# Altium project PCB_Project-LEDs.PrjPCB
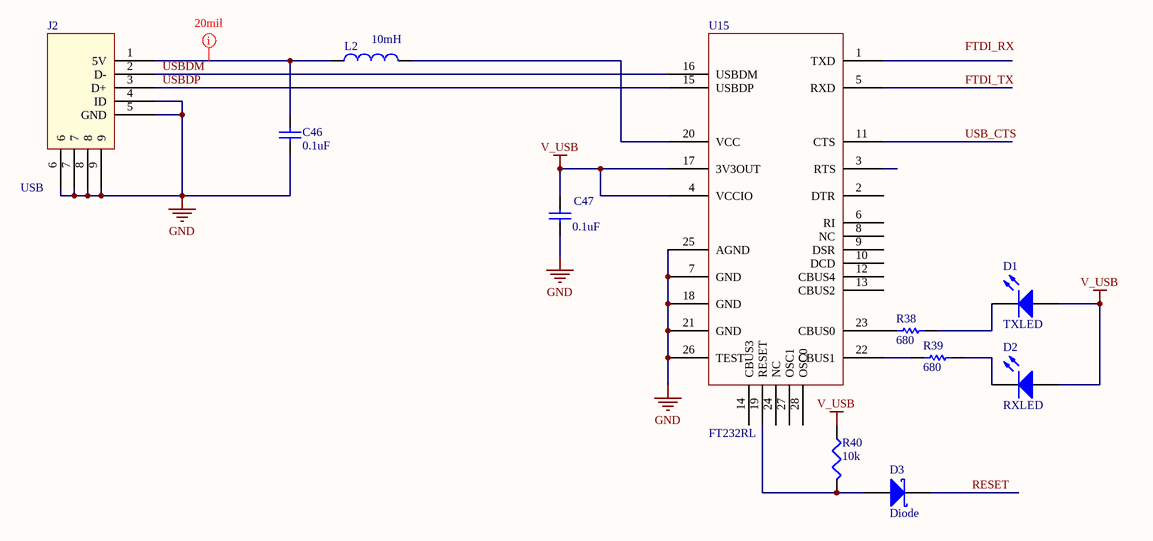
[diagram p0: USB.SchDoc]
6 sheets, 120 parts. Net scope: global (net labels, ports and power ports of the same name join across sheets).
Board file: LED_PCB.PcbDoc
Sheets:
  USB.SchDoc
  BLUELED.SchDoc
  REDLED.SchDoc
  TILE_DEMUX.SchDoc
  NEWLED.SchDoc
  LED_HEADERS.SchDoc

## Sheet USB.SchDoc
size A

### Parts
C46  value 0.1uF  [CAPC1005L]
C47  value 0.1uF  [CAPC1005L]
D1  TXLED  [INDC2012L]
D2  RXLED  [INDC2012L]
D3  Diode  [SurfaceMount(603)]
J2  USB  [USB Minib (thru-hole)]
L2  value 10mH  [INDC2012L]  (hidden comment: Inductor)
R38  value 680  [RESC1608L]
R39  value 680  [RESC1608L]
R40  value 10k  [RESC1608L]  (hidden comment: Res3)
U15  FT232RL  [SSOP-28]

### Nets
GND: C46.1 C47.1 J2.4(ID) J2.5(GND) J2.6 J2.7 J2.8 J2.9 U15.7(GND) U15.18(GND) U15.21(GND) U15.25(AGND) U15.26(TEST)
V_USB: C47.2 D1.1(A) D2.1(A) R40.1 U15.4(VCCIO) U15.17(3V3OUT)
FTDI_TX: U15.5(RXD)
RESET: D3.1(K)
USB_CTS: U15.11(CTS)
USBDM: J2.2(D-) U15.16(USBDM)
USBDP: J2.3(D+) U15.15(USBDP)
NetC46_2: C46.2 J2.1(5V) L2.1
NetD1_2: D1.2(K) R38.2
NetD2_2: D2.2(K) R39.2
NetD3_3: D3.3(A) R40.2 U15.19(RESET)
NetL2_2: L2.2 U15.20(VCC)
NetR38_1: R38.1 U15.23(CBUS0)
NetR39_1: R39.1 U15.22(CBUS1)

Not connected (* = marked no-connect by the designer): U15 1(TXD) 2(DTR) 3(RTS) 6(RI) 8(NC) 9(DSR) 10(DCD) 12(CBUS4) 13(CBUS2) 14(CBUS3) 24(NC) 27(OSC1) 28(OSC0)

### Layout directives
rule Width Constraint [Pref Width = 10mil    Min Width = 10mil    Max Width = 20mil]: NetC46_2

### Notes on the sheet
- Labels drawn without touching a wire or pin: FTDI_RX

### Library data of the parts
C46 C47 = Cap: Capacitor; Published: 8-Jun-2000; LatestRevisionDate: 17-Jul-2002; LatestRevisionNote: Re-released for DXP Platform.; PackageReference: RAD-0.3; Publisher: Altium Limited
D1 D2 = LED2: Typical RED, GREEN, YELLOW, AMBER GaAs LED; Published: 8-Jun-2000; LatestRevisionDate: 17-Jul-2002; LatestRevisionNote: Re-released for DXP Platform.; PackageVersion: Feb-2002; PackageReference: 3.2X1.6X1.1; Publisher: Altium Limited
D3 = SchottkeyDiode
J2 = USB-ConnTH
L2 = Inductor: Code_IEC: 1005; Published: 8-Jun-2000; LatestRevisionDate: 29-May-2009; LatestRevisionNote: IPC-7351 Footprint Added.; PackageReference: 0402-A; Publisher: Altium Limited; PackageDescription: Chip Inductor; Code_JEITA: 0402
R38 R39 = Res1: Resistor; Published: 8-Jun-2000; LatestRevisionDate: 17-Jul-2002; LatestRevisionNote: Re-released for DXP Platform.; PackageReference: AXIAL-0.3; Publisher: Altium Limited
R40 = Res3: Resistor; Published: 8-Jun-2000; LatestRevisionDate: 29-May-2009; LatestRevisionNote: IPC-7351 Footprint Added.; PackageReference: J1-0603; Publisher: Altium Limited; PackageDescription: Chip Resistor

## Sheet BLUELED.SchDoc
size A
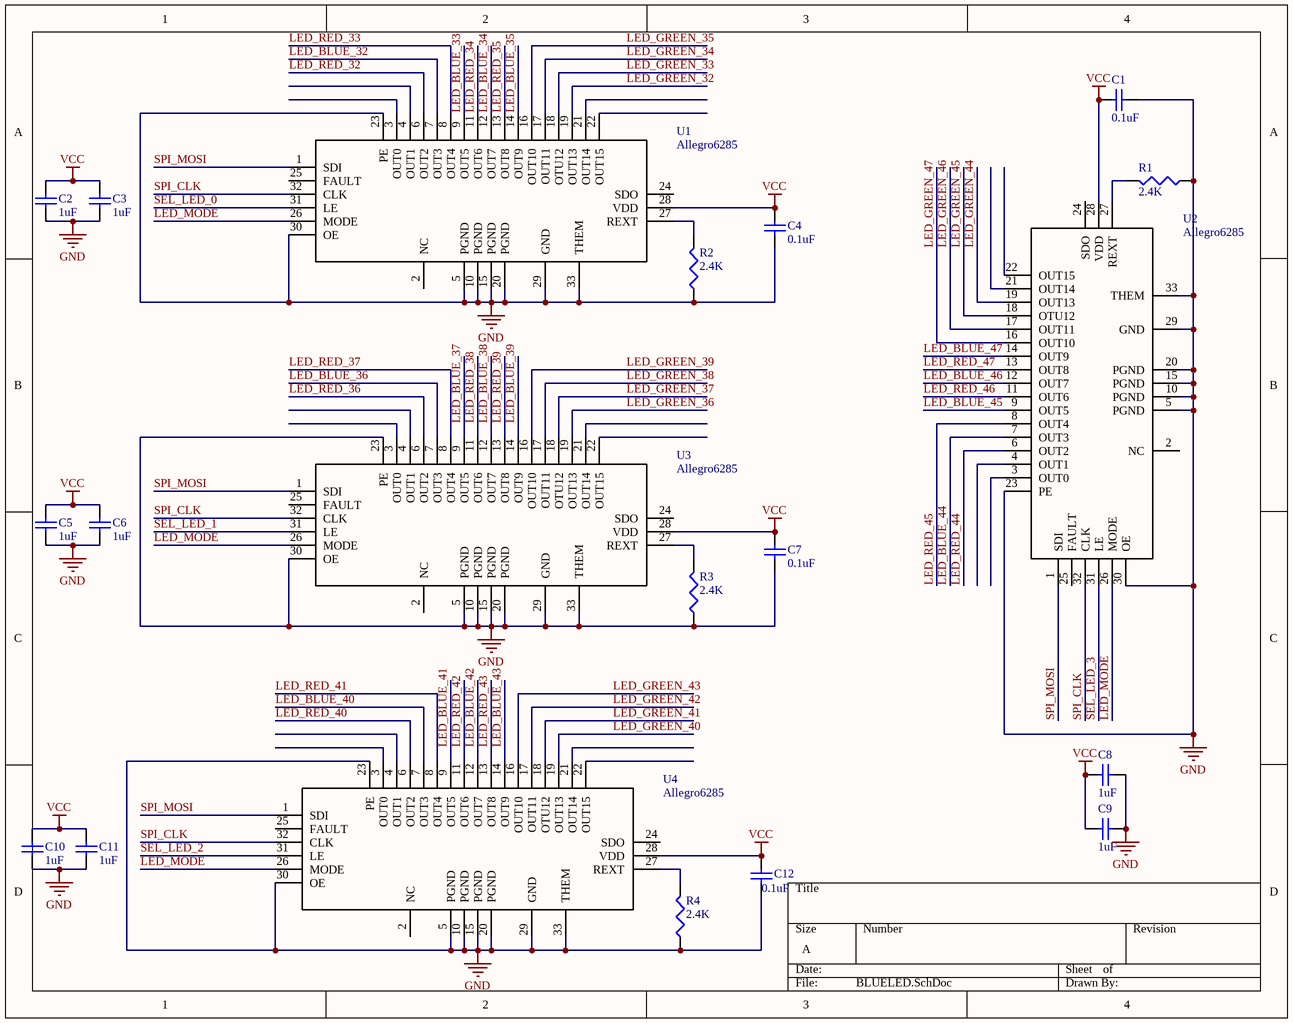
[diagram p1: BLUELED.SchDoc]

### Parts
C1  value 0.1uF  [CAPC1005L]  (hidden comment: Cap Semi)
C2  value 1uF  [CAPC1608L]  (hidden comment: Cap Semi)
C3  value 1uF  [CAPC1608L]  (hidden comment: Cap Semi)
C4  value 0.1uF  [CAPC1005L]  (hidden comment: Cap Semi)
C5  value 1uF  [CAPC1608L]  (hidden comment: Cap Semi)
C6  value 1uF  [CAPC1608L]  (hidden comment: Cap Semi)
C7  value 0.1uF  [CAPC1005L]  (hidden comment: Cap Semi)
C8  value 1uF  [CAPC1608L]  (hidden comment: Cap Semi)
C9  value 1uF  [CAPC1608L]  (hidden comment: Cap Semi)
C10  value 1uF  [CAPC1608L]  (hidden comment: Cap Semi)
C11  value 1uF  [CAPC1608L]  (hidden comment: Cap Semi)
C12  value 0.1uF  [CAPC1005L]  (hidden comment: Cap Semi)
R1  value 2.4K  [RESC1608L]  (hidden comment: Res3)
R2  value 2.4K  [RESC1608L]  (hidden comment: Res3)
R3  value 2.4K  [RESC1608L]  (hidden comment: Res3)
R4  value 2.4K  [RESC1608L]  (hidden comment: Res3)
U1  Allegro6285  [QFN-32]
U2  Allegro6285  [QFN-32]
U3  Allegro6285  [QFN-32]
U4  Allegro6285  [QFN-32]

### Nets
GND: C1.1 C2.1 C3.1 C4.1 C5.1 C6.1 C7.1 C8.1 C9.1 C10.1 C11.1 C12.1 R1.1 R2.1 R3.1 R4.1 U1.5(PGND) U1.10(PGND) U1.15(PGND) U1.20(PGND) U1.23(PE) U1.29(GND) U1.30(OE) U1.33(THEM) U2.5(PGND) U2.10(PGND) U2.15(PGND) U2.20(PGND) U2.23(PE) U2.29(GND) U2.30(OE) U2.33(THEM) U3.5(PGND) U3.10(PGND) U3.15(PGND) U3.20(PGND) U3.23(PE) U3.29(GND) U3.30(OE) U3.33(THEM) U4.5(PGND) U4.10(PGND) U4.15(PGND) U4.20(PGND) U4.23(PE) U4.29(GND) U4.30(OE) U4.33(THEM)
VCC: C1.2 C2.2 C3.2 C4.2 C5.2 C6.2 C7.2 C8.2 C9.2 C10.2 C11.2 C12.2 U1.28(VDD) U2.28(VDD) U3.28(VDD) U4.28(VDD)
LED_BLUE_32: U1.7(OUT3)
LED_BLUE_33: U1.9(OUT5)
LED_BLUE_34: U1.12(OUT7)
LED_BLUE_35: U1.14(OUT9)
LED_BLUE_36: U3.7(OUT3)
LED_BLUE_37: U3.9(OUT5)
LED_BLUE_38: U3.12(OUT7)
LED_BLUE_39: U3.14(OUT9)
LED_BLUE_40: U4.7(OUT3)
LED_BLUE_41: U4.9(OUT5)
LED_BLUE_42: U4.12(OUT7)
LED_BLUE_43: U4.14(OUT9)
LED_BLUE_44: U2.7(OUT3)
LED_BLUE_45: U2.9(OUT5)
LED_BLUE_46: U2.12(OUT7)
LED_BLUE_47: U2.14(OUT9)
LED_GREEN_32: U1.19(OUT13)
LED_GREEN_33: U1.18(OTU12)
LED_GREEN_34: U1.17(OUT11)
LED_GREEN_35: U1.16(OUT10)
LED_GREEN_36: U3.19(OUT13)
LED_GREEN_37: U3.18(OTU12)
LED_GREEN_38: U3.17(OUT11)
LED_GREEN_39: U3.16(OUT10)
LED_GREEN_40: U4.19(OUT13)
LED_GREEN_41: U4.18(OTU12)
LED_GREEN_42: U4.17(OUT11)
LED_GREEN_43: U4.16(OUT10)
LED_GREEN_44: U2.19(OUT13)
LED_GREEN_45: U2.18(OTU12)
LED_GREEN_46: U2.17(OUT11)
LED_GREEN_47: U2.16(OUT10)
LED_MODE: U1.26(MODE) U2.26(MODE) U3.26(MODE) U4.26(MODE)
LED_RED_32: U1.6(OUT2)
LED_RED_33: U1.8(OUT4)
LED_RED_34: U1.11(OUT6)
LED_RED_35: U1.13(OUT8)
LED_RED_36: U3.6(OUT2)
LED_RED_37: U3.8(OUT4)
LED_RED_38: U3.11(OUT6)
LED_RED_39: U3.13(OUT8)
LED_RED_40: U4.6(OUT2)
LED_RED_41: U4.8(OUT4)
LED_RED_42: U4.11(OUT6)
LED_RED_43: U4.13(OUT8)
LED_RED_44: U2.6(OUT2)
LED_RED_45: U2.8(OUT4)
LED_RED_46: U2.11(OUT6)
LED_RED_47: U2.13(OUT8)
SEL_LED_0: U1.31(LE)
SEL_LED_1: U3.31(LE)
SEL_LED_2: U4.31(LE)
SEL_LED_3: U2.31(LE)
SPI_CLK: U1.32(CLK) U2.32(CLK) U3.32(CLK) U4.32(CLK)
SPI_MOSI: U1.1(SDI) U2.1(SDI) U3.1(SDI) U4.1(SDI)
NetR1_2: R1.2 U2.27(REXT)
NetR2_2: R2.2 U1.27(REXT)
NetR3_2: R3.2 U3.27(REXT)
NetR4_2: R4.2 U4.27(REXT)

Not connected (* = marked no-connect by the designer): U1 2(NC) 3(OUT0) 4(OUT1) 21(OUT14) 22(OUT15) 24(SDO) 25(FAULT); U2 2(NC) 3(OUT0) 4(OUT1) 21(OUT14) 22(OUT15) 24(SDO) 25(FAULT); U3 2(NC) 3(OUT0) 4(OUT1) 21(OUT14) 22(OUT15) 24(SDO) 25(FAULT); U4 2(NC) 3(OUT0) 4(OUT1) 21(OUT14) 22(OUT15) 24(SDO) 25(FAULT)

### Library data of the parts
C1-C12 = Cap Semi: Capacitor (Semiconductor SIM Model); Published: 8-Jun-2000; LatestRevisionDate: 29-May-2009; LatestRevisionNote: IPC-7351 Footprint Added.; PackageReference: C1206; Publisher: Altium Limited; PackageDescription: Chip Capacitor
R1-R4 = Res3: Resistor; Published: 8-Jun-2000; LatestRevisionDate: 29-May-2009; LatestRevisionNote: IPC-7351 Footprint Added.; PackageReference: J1-0603; Publisher: Altium Limited; PackageDescription: Chip Resistor

## Sheet REDLED.SchDoc
size A
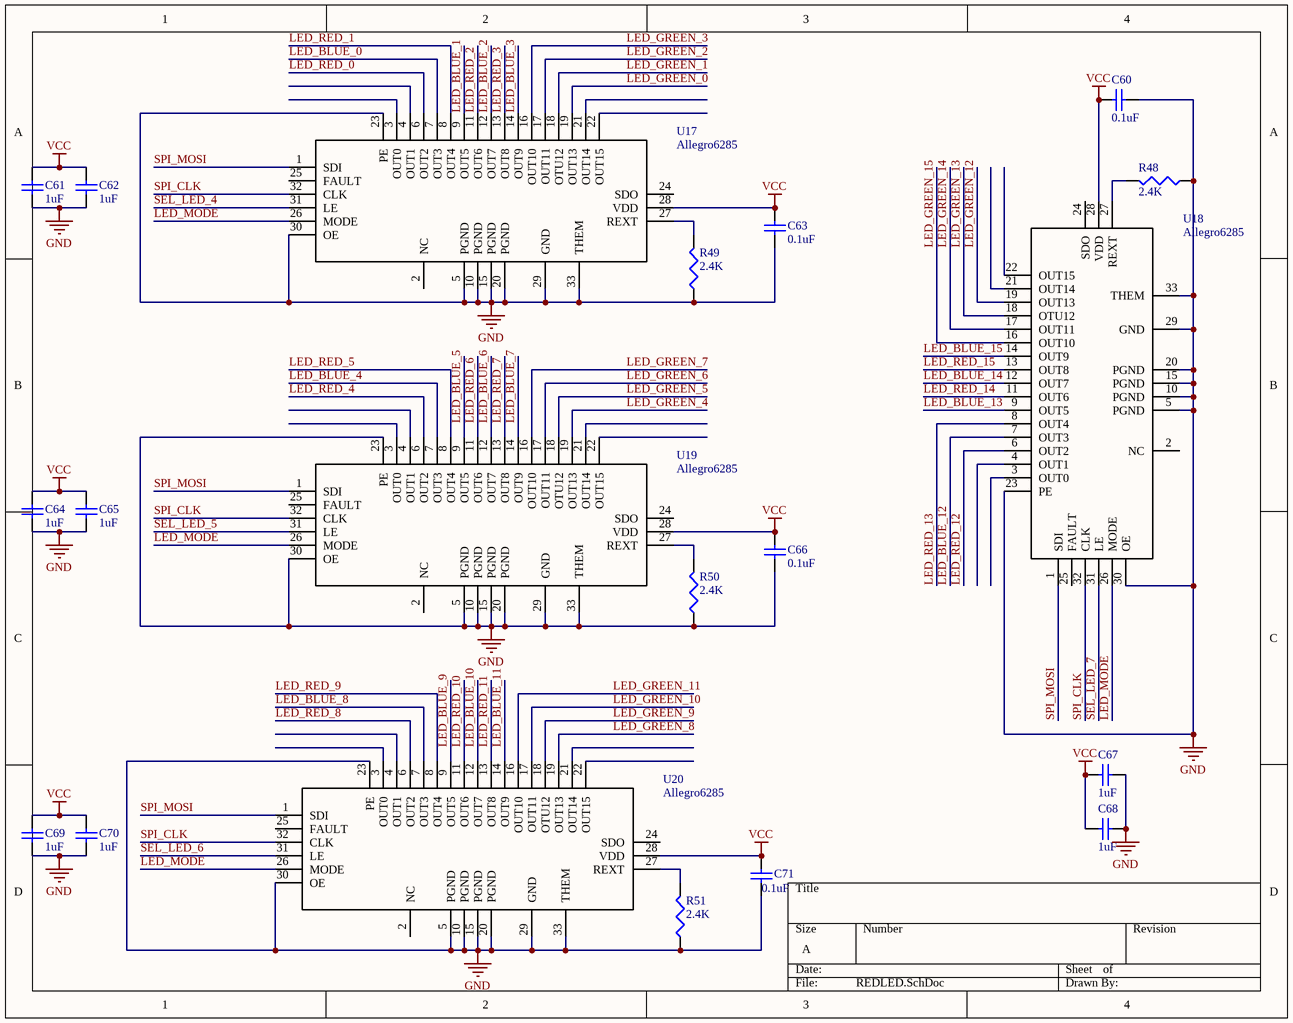
[diagram p2: REDLED.SchDoc]

### Parts
C60  value 0.1uF  [CAPC1005L]  (hidden comment: Cap Semi)
C61  value 1uF  [CAPC1608L]  (hidden comment: Cap Semi)
C62  value 1uF  [CAPC1608L]  (hidden comment: Cap Semi)
C63  value 0.1uF  [CAPC1005L]  (hidden comment: Cap Semi)
C64  value 1uF  [CAPC1608L]  (hidden comment: Cap Semi)
C65  value 1uF  [CAPC1608L]  (hidden comment: Cap Semi)
C66  value 0.1uF  [CAPC1005L]  (hidden comment: Cap Semi)
C67  value 1uF  [CAPC1608L]  (hidden comment: Cap Semi)
C68  value 1uF  [CAPC1608L]  (hidden comment: Cap Semi)
C69  value 1uF  [CAPC1608L]  (hidden comment: Cap Semi)
C70  value 1uF  [CAPC1608L]  (hidden comment: Cap Semi)
C71  value 0.1uF  [CAPC1005L]  (hidden comment: Cap Semi)
R48  value 2.4K  [RESC1608L]  (hidden comment: Res3)
R49  value 2.4K  [RESC1608L]  (hidden comment: Res3)
R50  value 2.4K  [RESC1608L]  (hidden comment: Res3)
R51  value 2.4K  [RESC1608L]  (hidden comment: Res3)
U17  Allegro6285  [QFN-32]
U18  Allegro6285  [QFN-32]
U19  Allegro6285  [QFN-32]
U20  Allegro6285  [QFN-32]

### Nets
GND: C60.1 C61.1 C62.1 C63.1 C64.1 C65.1 C66.1 C67.1 C68.1 C69.1 C70.1 C71.1 R48.1 R49.1 R50.1 R51.1 U17.5(PGND) U17.10(PGND) U17.15(PGND) U17.20(PGND) U17.23(PE) U17.29(GND) U17.30(OE) U17.33(THEM) U18.5(PGND) U18.10(PGND) U18.15(PGND) U18.20(PGND) U18.23(PE) U18.29(GND) U18.30(OE) U18.33(THEM) U19.5(PGND) U19.10(PGND) U19.15(PGND) U19.20(PGND) U19.23(PE) U19.29(GND) U19.30(OE) U19.33(THEM) U20.5(PGND) U20.10(PGND) U20.15(PGND) U20.20(PGND) U20.23(PE) U20.29(GND) U20.30(OE) U20.33(THEM)
VCC: C60.2 C61.2 C62.2 C63.2 C64.2 C65.2 C66.2 C67.2 C68.2 C69.2 C70.2 C71.2 U17.28(VDD) U18.28(VDD) U19.28(VDD) U20.28(VDD)
LED_BLUE_0: U17.7(OUT3)
LED_BLUE_1: U17.9(OUT5)
LED_BLUE_2: U17.12(OUT7)
LED_BLUE_3: U17.14(OUT9)
LED_BLUE_4: U19.7(OUT3)
LED_BLUE_5: U19.9(OUT5)
LED_BLUE_6: U19.12(OUT7)
LED_BLUE_7: U19.14(OUT9)
LED_BLUE_8: U20.7(OUT3)
LED_BLUE_9: U20.9(OUT5)
LED_BLUE_10: U20.12(OUT7)
LED_BLUE_11: U20.14(OUT9)
LED_BLUE_12: U18.7(OUT3)
LED_BLUE_13: U18.9(OUT5)
LED_BLUE_14: U18.12(OUT7)
LED_BLUE_15: U18.14(OUT9)
LED_GREEN_0: U17.19(OUT13)
LED_GREEN_1: U17.18(OTU12)
LED_GREEN_2: U17.17(OUT11)
LED_GREEN_3: U17.16(OUT10)
LED_GREEN_4: U19.19(OUT13)
LED_GREEN_5: U19.18(OTU12)
LED_GREEN_6: U19.17(OUT11)
LED_GREEN_7: U19.16(OUT10)
LED_GREEN_8: U20.19(OUT13)
LED_GREEN_9: U20.18(OTU12)
LED_GREEN_10: U20.17(OUT11)
LED_GREEN_11: U20.16(OUT10)
LED_GREEN_12: U18.19(OUT13)
LED_GREEN_13: U18.18(OTU12)
LED_GREEN_14: U18.17(OUT11)
LED_GREEN_15: U18.16(OUT10)
LED_MODE: U17.26(MODE) U18.26(MODE) U19.26(MODE) U20.26(MODE)
LED_RED_0: U17.6(OUT2)
LED_RED_1: U17.8(OUT4)
LED_RED_2: U17.11(OUT6)
LED_RED_3: U17.13(OUT8)
LED_RED_4: U19.6(OUT2)
LED_RED_5: U19.8(OUT4)
LED_RED_6: U19.11(OUT6)
LED_RED_7: U19.13(OUT8)
LED_RED_8: U20.6(OUT2)
LED_RED_9: U20.8(OUT4)
LED_RED_10: U20.11(OUT6)
LED_RED_11: U20.13(OUT8)
LED_RED_12: U18.6(OUT2)
LED_RED_13: U18.8(OUT4)
LED_RED_14: U18.11(OUT6)
LED_RED_15: U18.13(OUT8)
SEL_LED_4: U17.31(LE)
SEL_LED_5: U19.31(LE)
SEL_LED_6: U20.31(LE)
SEL_LED_7: U18.31(LE)
SPI_CLK: U17.32(CLK) U18.32(CLK) U19.32(CLK) U20.32(CLK)
SPI_MOSI: U17.1(SDI) U18.1(SDI) U19.1(SDI) U20.1(SDI)
NetR48_2: R48.2 U18.27(REXT)
NetR49_2: R49.2 U17.27(REXT)
NetR50_2: R50.2 U19.27(REXT)
NetR51_2: R51.2 U20.27(REXT)

Not connected (* = marked no-connect by the designer): U17 2(NC) 3(OUT0) 4(OUT1) 21(OUT14) 22(OUT15) 24(SDO) 25(FAULT); U18 2(NC) 3(OUT0) 4(OUT1) 21(OUT14) 22(OUT15) 24(SDO) 25(FAULT); U19 2(NC) 3(OUT0) 4(OUT1) 21(OUT14) 22(OUT15) 24(SDO) 25(FAULT); U20 2(NC) 3(OUT0) 4(OUT1) 21(OUT14) 22(OUT15) 24(SDO) 25(FAULT)

### Library data of the parts
C60-C71 = Cap Semi: Capacitor (Semiconductor SIM Model); Published: 8-Jun-2000; LatestRevisionDate: 29-May-2009; LatestRevisionNote: IPC-7351 Footprint Added.; PackageReference: C1206; Publisher: Altium Limited; PackageDescription: Chip Capacitor
R48-R51 = Res3: Resistor; Published: 8-Jun-2000; LatestRevisionDate: 29-May-2009; LatestRevisionNote: IPC-7351 Footprint Added.; PackageReference: J1-0603; Publisher: Altium Limited; PackageDescription: Chip Resistor

## Sheet TILE_DEMUX.SchDoc
size A
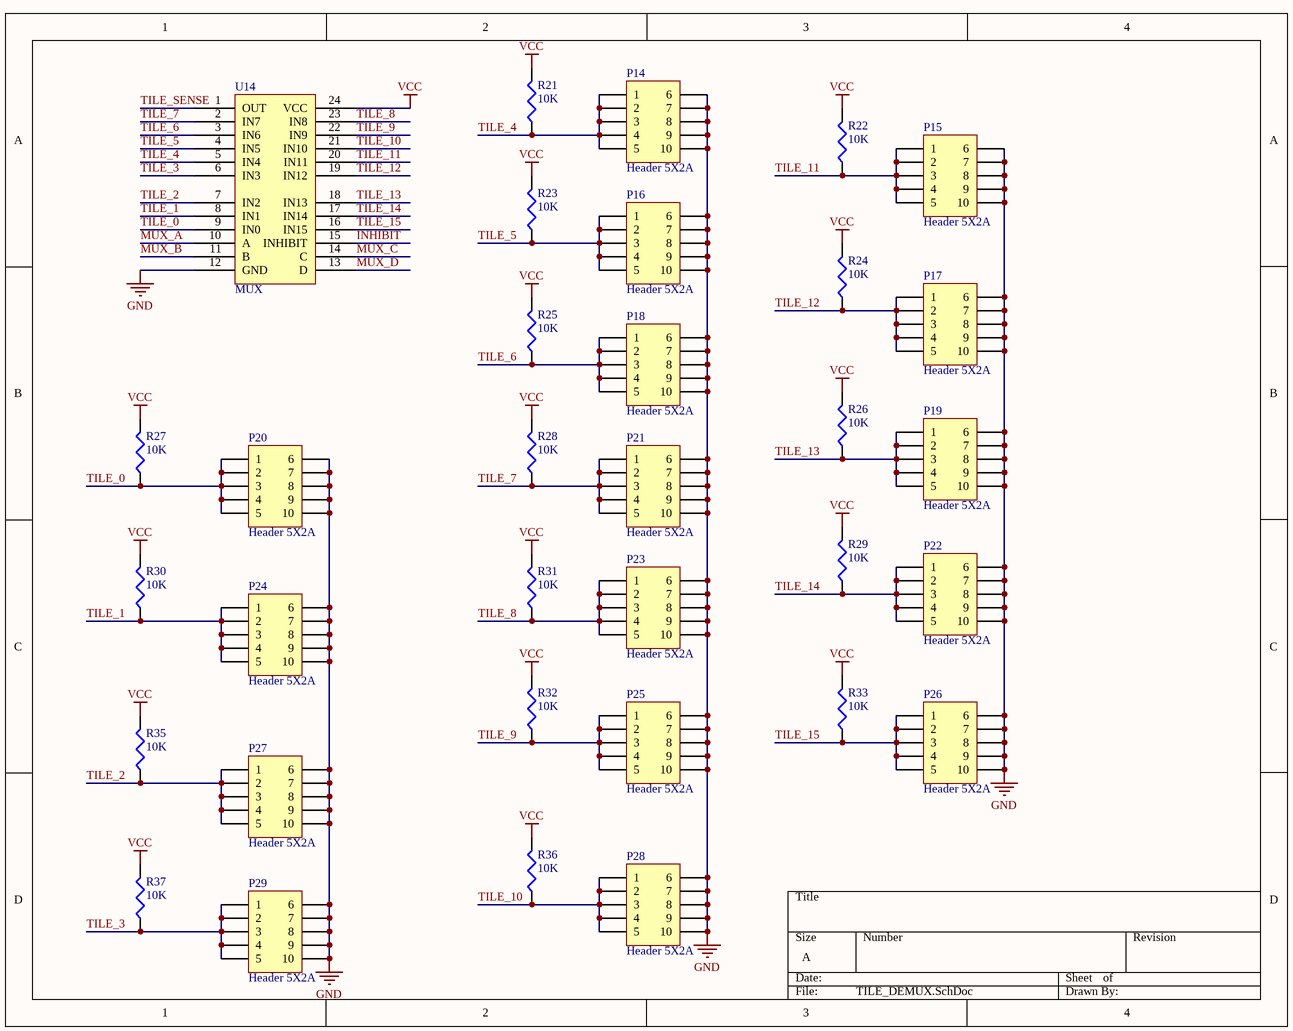
[diagram p3: TILE_DEMUX.SchDoc]

### Parts
P14  Header 5X2A  [HDR2X5_CEN]
P15  Header 5X2A  [HDR2X5_CEN]
P16  Header 5X2A  [HDR2X5_CEN]
P17  Header 5X2A  [HDR2X5_CEN]
P18  Header 5X2A  [HDR2X5_CEN]
P19  Header 5X2A  [HDR2X5_CEN]
P20  Header 5X2A  [HDR2X5_CEN]
P21  Header 5X2A  [HDR2X5_CEN]
P22  Header 5X2A  [HDR2X5_CEN]
P23  Header 5X2A  [HDR2X5_CEN]
P24  Header 5X2A  [HDR2X5_CEN]
P25  Header 5X2A  [HDR2X5_CEN]
P26  Header 5X2A  [HDR2X5_CEN]
P27  Header 5X2A  [HDR2X5_CEN]
P28  Header 5X2A  [HDR2X5_CEN]
P29  Header 5X2A  [HDR2X5_CEN]
R21  value 10K  [RESC1608L]  (hidden comment: Res3)
R22  value 10K  [RESC1608L]  (hidden comment: Res3)
R23  value 10K  [RESC1608L]  (hidden comment: Res3)
R24  value 10K  [RESC1608L]  (hidden comment: Res3)
R25  value 10K  [RESC1608L]  (hidden comment: Res3)
R26  value 10K  [RESC1608L]  (hidden comment: Res3)
R27  value 10K  [RESC1608L]  (hidden comment: Res3)
R28  value 10K  [RESC1608L]  (hidden comment: Res3)
R29  value 10K  [RESC1608L]  (hidden comment: Res3)
R30  value 10K  [RESC1608L]  (hidden comment: Res3)
R31  value 10K  [RESC1608L]  (hidden comment: Res3)
R32  value 10K  [RESC1608L]  (hidden comment: Res3)
R33  value 10K  [RESC1608L]  (hidden comment: Res3)
R35  value 10K  [RESC1608L]  (hidden comment: Res3)
R36  value 10K  [RESC1608L]  (hidden comment: Res3)
R37  value 10K  [RESC1608L]  (hidden comment: Res3)
U14  MUX  [SOIC-24MUX]

### Nets
GND: P14.6 P14.7 P14.8 P14.9 P14.10 P15.6 P15.7 P15.8 P15.9 P15.10 P16.6 P16.7 P16.8 P16.9 P16.10 P17.6 P17.7 P17.8 P17.9 P17.10 P18.6 P18.7 P18.8 P18.9 P18.10 P19.6 P19.7 P19.8 P19.9 P19.10 P20.6 P20.7 P20.8 P20.9 P20.10 P21.6 P21.7 P21.8 P21.9 P21.10 P22.6 P22.7 P22.8 P22.9 P22.10 P23.6 P23.7 P23.8 P23.9 P23.10 P24.6 P24.7 P24.8 P24.9 P24.10 P25.6 P25.7 P25.8 P25.9 P25.10 P26.6 P26.7 P26.8 P26.9 P26.10 P27.6 P27.7 P27.8 P27.9 P27.10 P28.6 P28.7 P28.8 P28.9 P28.10 P29.6 P29.7 P29.8 P29.9 P29.10 U14.12(GND)
VCC: R21.2 R22.2 R23.2 R24.2 R25.2 R26.2 R27.2 R28.2 R29.2 R30.2 R31.2 R32.2 R33.2 R35.2 R36.2 R37.2 U14.24(VCC)
INHIBIT: U14.15(INHIBIT)
MUX_A: U14.10(A)
MUX_B: U14.11(B)
MUX_C: U14.14(C)
MUX_D: U14.13(D)
TILE_0: P20.1 P20.2 P20.3 P20.4 P20.5 R27.1 U14.9(IN0)
TILE_1: P24.1 P24.2 P24.3 P24.4 P24.5 R30.1 U14.8(IN1)
TILE_2: P27.1 P27.2 P27.3 P27.4 P27.5 R35.1 U14.7(IN2)
TILE_3: P29.1 P29.2 P29.3 P29.4 P29.5 R37.1 U14.6(IN3)
TILE_4: P14.1 P14.2 P14.3 P14.4 P14.5 R21.1 U14.5(IN4)
TILE_5: P16.1 P16.2 P16.3 P16.4 P16.5 R23.1 U14.4(IN5)
TILE_6: P18.1 P18.2 P18.3 P18.4 P18.5 R25.1 U14.3(IN6)
TILE_7: P21.1 P21.2 P21.3 P21.4 P21.5 R28.1 U14.2(IN7)
TILE_8: P23.1 P23.2 P23.3 P23.4 P23.5 R31.1 U14.23(IN8)
TILE_9: P25.1 P25.2 P25.3 P25.4 P25.5 R32.1 U14.22(IN9)
TILE_10: P28.1 P28.2 P28.3 P28.4 P28.5 R36.1 U14.21(IN10)
TILE_11: P15.1 P15.2 P15.3 P15.4 P15.5 R22.1 U14.20(IN11)
TILE_12: P17.1 P17.2 P17.3 P17.4 P17.5 R24.1 U14.19(IN12)
TILE_13: P19.1 P19.2 P19.3 P19.4 P19.5 R26.1 U14.18(IN13)
TILE_14: P22.1 P22.2 P22.3 P22.4 P22.5 R29.1 U14.17(IN14)
TILE_15: P26.1 P26.2 P26.3 P26.4 P26.5 R33.1 U14.16(IN15)
TILE_SENSE: U14.1(OUT)

### Library data of the parts
P14-P29 = Header 5X2A: Header, 5-Pin, Dual row; LatestRevisionDate: 17-Jul-2002; LatestRevisionNote: Re-released for DXP Platform.; Publisher: Altium Limited
R21-R33 R35-R37 = Res3: Resistor; Published: 8-Jun-2000; LatestRevisionDate: 29-May-2009; LatestRevisionNote: IPC-7351 Footprint Added.; PackageReference: J1-0603; Publisher: Altium Limited; PackageDescription: Chip Resistor

## Sheet NEWLED.SchDoc
size A
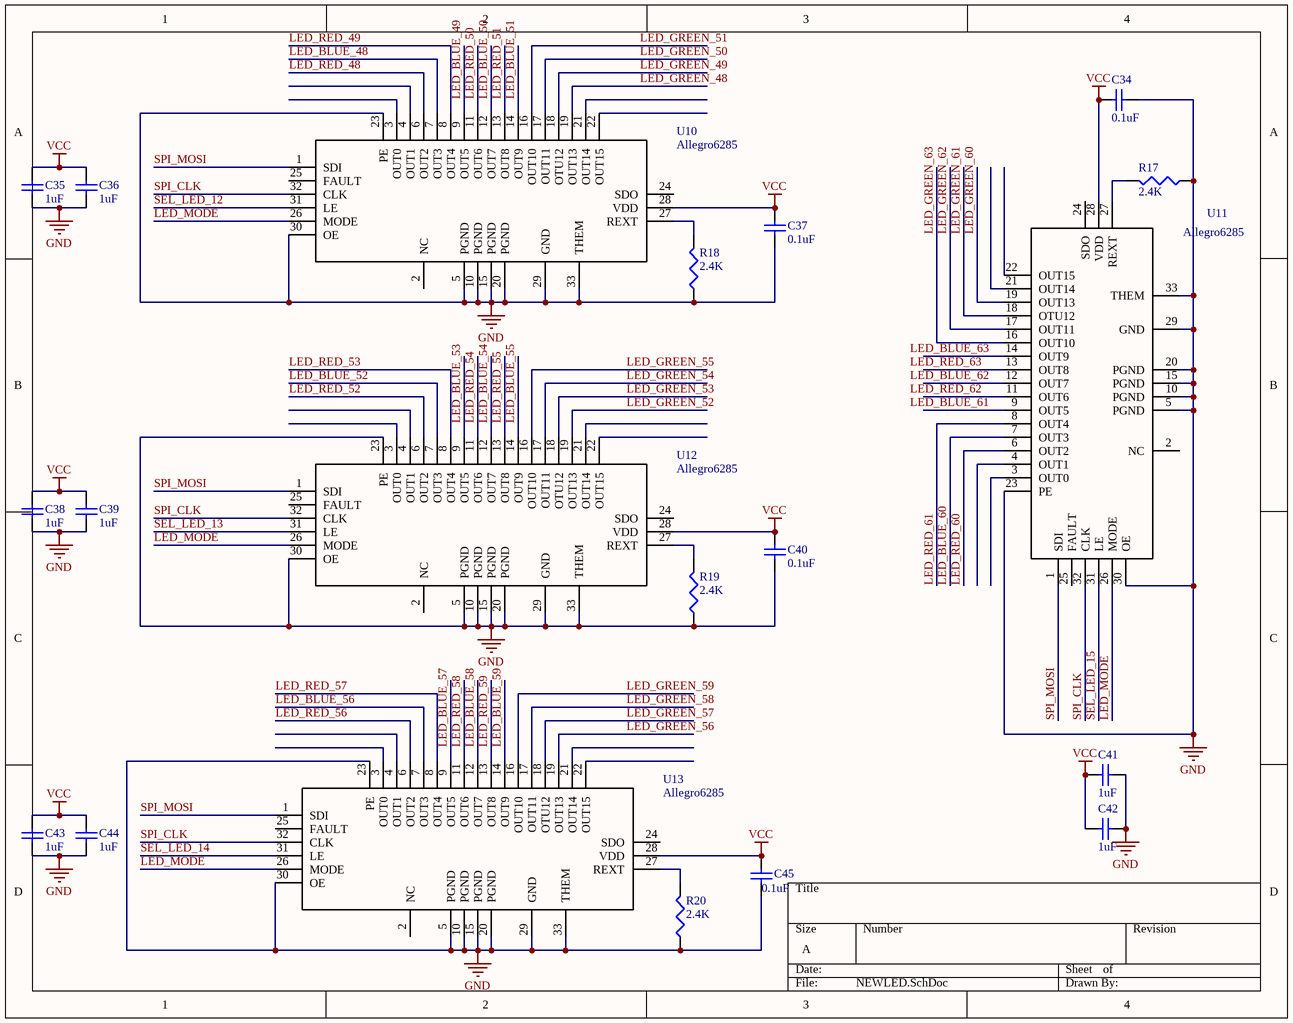
[diagram p4: NEWLED.SchDoc]

### Parts
C34  value 0.1uF  [CAPC1005L]  (hidden comment: Cap Semi)
C35  value 1uF  [CAPC1608L]  (hidden comment: Cap Semi)
C36  value 1uF  [CAPC1608L]  (hidden comment: Cap Semi)
C37  value 0.1uF  [CAPC1005L]  (hidden comment: Cap Semi)
C38  value 1uF  [CAPC1608L]  (hidden comment: Cap Semi)
C39  value 1uF  [CAPC1608L]  (hidden comment: Cap Semi)
C40  value 0.1uF  [CAPC1005L]  (hidden comment: Cap Semi)
C41  value 1uF  [CAPC1608L]  (hidden comment: Cap Semi)
C42  value 1uF  [CAPC1608L]  (hidden comment: Cap Semi)
C43  value 1uF  [CAPC1608L]  (hidden comment: Cap Semi)
C44  value 1uF  [CAPC1608L]  (hidden comment: Cap Semi)
C45  value 0.1uF  [CAPC1005L]  (hidden comment: Cap Semi)
R17  value 2.4K  [RESC1608L]  (hidden comment: Res3)
R18  value 2.4K  [RESC1608L]  (hidden comment: Res3)
R19  value 2.4K  [RESC1608L]  (hidden comment: Res3)
R20  value 2.4K  [RESC1608L]  (hidden comment: Res3)
U10  Allegro6285  [QFN-32]
U11  Allegro6285  [QFN-32]
U12  Allegro6285  [QFN-32]
U13  Allegro6285  [QFN-32]

### Nets
GND: C34.1 C35.1 C36.1 C37.1 C38.1 C39.1 C40.1 C41.1 C42.1 C43.1 C44.1 C45.1 R17.1 R18.1 R19.1 R20.1 U10.5(PGND) U10.10(PGND) U10.15(PGND) U10.20(PGND) U10.23(PE) U10.29(GND) U10.30(OE) U10.33(THEM) U11.5(PGND) U11.10(PGND) U11.15(PGND) U11.20(PGND) U11.23(PE) U11.29(GND) U11.30(OE) U11.33(THEM) U12.5(PGND) U12.10(PGND) U12.15(PGND) U12.20(PGND) U12.23(PE) U12.29(GND) U12.30(OE) U12.33(THEM) U13.5(PGND) U13.10(PGND) U13.15(PGND) U13.20(PGND) U13.23(PE) U13.29(GND) U13.30(OE) U13.33(THEM)
VCC: C34.2 C35.2 C36.2 C37.2 C38.2 C39.2 C40.2 C41.2 C42.2 C43.2 C44.2 C45.2 U10.28(VDD) U11.28(VDD) U12.28(VDD) U13.28(VDD)
LED_BLUE_48: U10.7(OUT3)
LED_BLUE_49: U10.9(OUT5)
LED_BLUE_50: U10.12(OUT7)
LED_BLUE_51: U10.14(OUT9)
LED_BLUE_52: U12.7(OUT3)
LED_BLUE_53: U12.9(OUT5)
LED_BLUE_54: U12.12(OUT7)
LED_BLUE_55: U12.14(OUT9)
LED_BLUE_56: U13.7(OUT3)
LED_BLUE_57: U13.9(OUT5)
LED_BLUE_58: U13.12(OUT7)
LED_BLUE_59: U13.14(OUT9)
LED_BLUE_60: U11.7(OUT3)
LED_GREEN_48: U10.19(OUT13)
LED_GREEN_49: U10.18(OTU12)
LED_GREEN_50: U10.17(OUT11)
LED_GREEN_51: U10.16(OUT10)
LED_GREEN_52: U12.19(OUT13)
LED_GREEN_53: U12.18(OTU12)
LED_GREEN_54: U12.17(OUT11)
LED_GREEN_55: U12.16(OUT10)
LED_GREEN_56: U13.19(OUT13)
LED_GREEN_57: U13.18(OTU12)
LED_GREEN_58: U13.17(OUT11)
LED_GREEN_59: U13.16(OUT10)
LED_GREEN_60: U11.19(OUT13)
LED_GREEN_61: U11.18(OTU12)
LED_GREEN_62: U11.17(OUT11)
LED_GREEN_63: U11.16(OUT10)
LED_MODE: U10.26(MODE) U11.26(MODE) U12.26(MODE) U13.26(MODE)
LED_RED_48: U10.6(OUT2)
LED_RED_49: U10.8(OUT4)
LED_RED_50: U10.11(OUT6)
LED_RED_51: U10.13(OUT8)
LED_RED_52: U12.6(OUT2)
LED_RED_53: U12.8(OUT4)
LED_RED_54: U12.11(OUT6)
LED_RED_55: U12.13(OUT8)
LED_RED_56: U13.6(OUT2)
LED_RED_57: U13.8(OUT4)
LED_RED_58: U13.11(OUT6)
LED_RED_59: U13.13(OUT8)
LED_RED_60: U11.6(OUT2)
LED_RED_61: U11.8(OUT4)
SEL_LED_12: U10.31(LE)
SEL_LED_13: U12.31(LE)
SEL_LED_14: U13.31(LE)
SEL_LED_15: U11.31(LE)
SPI_CLK: U10.32(CLK) U11.32(CLK) U12.32(CLK) U13.32(CLK)
SPI_MOSI: U10.1(SDI) U11.1(SDI) U12.1(SDI) U13.1(SDI)
NetR17_2: R17.2 U11.27(REXT)
NetR18_2: R18.2 U10.27(REXT)
NetR19_2: R19.2 U12.27(REXT)
NetR20_2: R20.2 U13.27(REXT)

Not connected (* = marked no-connect by the designer): U10 2(NC) 3(OUT0) 4(OUT1) 21(OUT14) 22(OUT15) 24(SDO) 25(FAULT); U11 2(NC) 3(OUT0) 4(OUT1) 9(OUT5) 11(OUT6) 12(OUT7) 13(OUT8) 14(OUT9) 21(OUT14) 22(OUT15) 24(SDO) 25(FAULT); U12 2(NC) 3(OUT0) 4(OUT1) 21(OUT14) 22(OUT15) 24(SDO) 25(FAULT); U13 2(NC) 3(OUT0) 4(OUT1) 21(OUT14) 22(OUT15) 24(SDO) 25(FAULT)

### Notes on the sheet
- Labels drawn without touching a wire or pin: LED_BLUE_61, LED_BLUE_62, LED_BLUE_63, LED_RED_62, LED_RED_63

### Library data of the parts
C34-C45 = Cap Semi: Capacitor (Semiconductor SIM Model); Published: 8-Jun-2000; LatestRevisionDate: 29-May-2009; LatestRevisionNote: IPC-7351 Footprint Added.; PackageReference: C1206; Publisher: Altium Limited; PackageDescription: Chip Capacitor
R17-R20 = Res3: Resistor; Published: 8-Jun-2000; LatestRevisionDate: 29-May-2009; LatestRevisionNote: IPC-7351 Footprint Added.; PackageReference: J1-0603; Publisher: Altium Limited; PackageDescription: Chip Resistor

## Sheet LED_HEADERS.SchDoc
size A
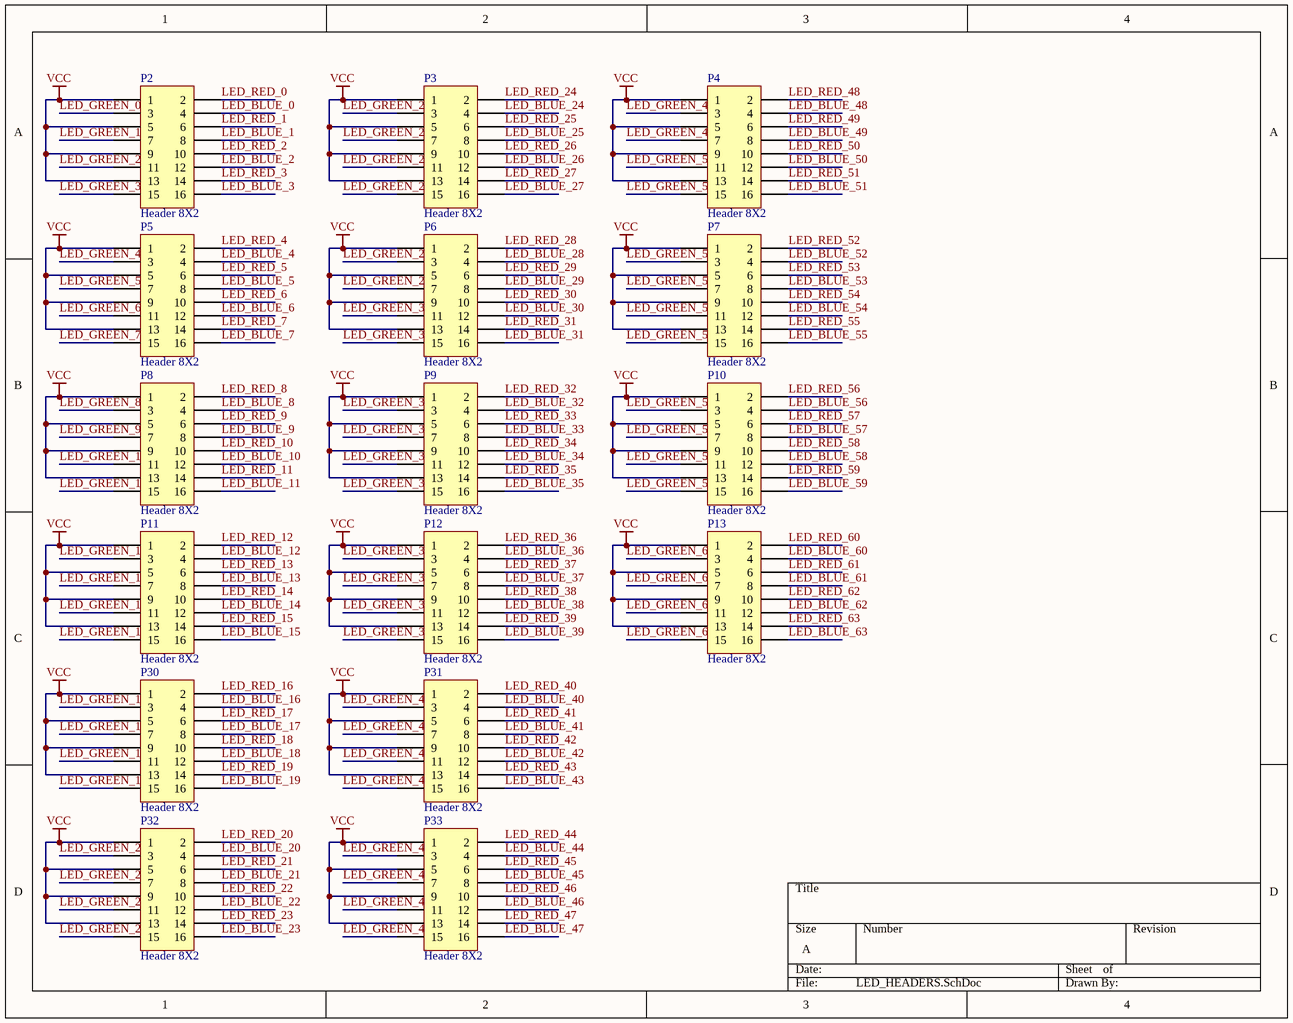
[diagram p5: LED_HEADERS.SchDoc]

### Parts
P2  Header 8X2  [HDR2X8]
P3  Header 8X2  [HDR2X8]
P4  Header 8X2  [HDR2X8]
P5  Header 8X2  [HDR2X8]
P6  Header 8X2  [HDR2X8]
P7  Header 8X2  [HDR2X8]
P8  Header 8X2  [HDR2X8]
P9  Header 8X2  [HDR2X8]
P10  Header 8X2  [HDR2X8]
P11  Header 8X2  [HDR2X8]
P12  Header 8X2  [HDR2X8]
P13  Header 8X2  [HDR2X8]
P30  Header 8X2  [HDR2X8]
P31  Header 8X2  [HDR2X8]
P32  Header 8X2  [HDR2X8]
P33  Header 8X2  [HDR2X8]

### Nets
VCC: P2.1 P2.5 P2.9 P2.13 P3.1 P3.5 P3.9 P3.13 P4.1 P4.5 P4.9 P4.13 P5.1 P5.5 P5.9 P5.13 P6.1 P6.5 P6.9 P6.13 P7.1 P7.5 P7.9 P7.13 P8.1 P8.5 P8.9 P8.13 P9.1 P9.5 P9.9 P9.13 P10.1 P10.5 P10.9 P10.13 P11.1 P11.5 P11.9 P11.13 P12.1 P12.5 P12.9 P12.13 P13.1 P13.5 P13.9 P13.13 P30.1 P30.5 P30.9 P30.13 P31.1 P31.5 P31.9 P31.13 P32.1 P32.5 P32.9 P32.13 P33.1 P33.5 P33.9 P33.13
LED_BLUE_0: P2.4
LED_BLUE_1: P2.8
LED_BLUE_2: P2.12
LED_BLUE_3: P2.16
LED_BLUE_4: P5.4
LED_BLUE_5: P5.8
LED_BLUE_6: P5.12
LED_BLUE_7: P5.16
LED_BLUE_8: P8.4
LED_BLUE_9: P8.8
LED_BLUE_10: P8.12
LED_BLUE_11: P8.16
LED_BLUE_12: P11.4
LED_BLUE_13: P11.8
LED_BLUE_14: P11.12
LED_BLUE_15: P11.16
LED_BLUE_16: P30.4
LED_BLUE_17: P30.8
LED_BLUE_18: P30.12
LED_BLUE_19: P30.16
LED_BLUE_20: P32.4
LED_BLUE_21: P32.8
LED_BLUE_22: P32.12
LED_BLUE_23: P32.16
LED_BLUE_24: P3.4
LED_BLUE_25: P3.8
LED_BLUE_26: P3.12
LED_BLUE_27: P3.16
LED_BLUE_28: P6.4
LED_BLUE_29: P6.8
LED_BLUE_30: P6.12
LED_BLUE_31: P6.16
LED_BLUE_32: P9.4
LED_BLUE_33: P9.8
LED_BLUE_34: P9.12
LED_BLUE_35: P9.16
LED_BLUE_36: P12.4
LED_BLUE_37: P12.8
LED_BLUE_38: P12.12
LED_BLUE_39: P12.16
LED_BLUE_40: P31.4
LED_BLUE_41: P31.8
LED_BLUE_42: P31.12
LED_BLUE_43: P31.16
LED_BLUE_44: P33.4
LED_BLUE_45: P33.8
LED_BLUE_46: P33.12
LED_BLUE_47: P33.16
LED_BLUE_48: P4.4
LED_BLUE_49: P4.8
LED_BLUE_50: P4.12
LED_BLUE_51: P4.16
LED_BLUE_52: P7.4
LED_BLUE_53: P7.8
LED_BLUE_54: P7.12
LED_BLUE_55: P7.16
LED_BLUE_56: P10.4
LED_BLUE_57: P10.8
LED_BLUE_58: P10.12
LED_BLUE_59: P10.16
LED_BLUE_60: P13.4
LED_BLUE_61: P13.8
LED_BLUE_62: P13.12
LED_BLUE_63: P13.16
LED_GREEN_0: P2.3
LED_GREEN_1: P2.7
LED_GREEN_2: P2.11
LED_GREEN_3: P2.15
LED_GREEN_4: P5.3
LED_GREEN_5: P5.7
LED_GREEN_6: P5.11
LED_GREEN_7: P5.15
LED_GREEN_8: P8.3
LED_GREEN_9: P8.7
LED_GREEN_10: P8.11
LED_GREEN_11: P8.15
LED_GREEN_12: P11.3
LED_GREEN_13: P11.7
LED_GREEN_14: P11.11
LED_GREEN_15: P11.15
LED_GREEN_16: P30.3
LED_GREEN_17: P30.7
LED_GREEN_18: P30.11
LED_GREEN_19: P30.15
LED_GREEN_20: P32.3
LED_GREEN_21: P32.7
LED_GREEN_22: P32.11
LED_GREEN_23: P32.15
LED_GREEN_24: P3.3
LED_GREEN_25: P3.7
LED_GREEN_26: P3.11
LED_GREEN_27: P3.15
LED_GREEN_28: P6.3
LED_GREEN_29: P6.7
LED_GREEN_30: P6.11
LED_GREEN_31: P6.15
LED_GREEN_32: P9.3
LED_GREEN_33: P9.7
LED_GREEN_34: P9.11
LED_GREEN_35: P9.15
LED_GREEN_36: P12.3
LED_GREEN_37: P12.7
LED_GREEN_38: P12.11
LED_GREEN_39: P12.15
LED_GREEN_40: P31.3
LED_GREEN_41: P31.7
LED_GREEN_42: P31.11
LED_GREEN_43: P31.15
LED_GREEN_44: P33.3
LED_GREEN_45: P33.7
LED_GREEN_46: P33.11
LED_GREEN_47: P33.15
LED_GREEN_48: P4.3
LED_GREEN_49: P4.7
LED_GREEN_50: P4.11
LED_GREEN_51: P4.15
LED_GREEN_52: P7.3
LED_GREEN_53: P7.7
LED_GREEN_54: P7.11
LED_GREEN_55: P7.15
LED_GREEN_56: P10.3
LED_GREEN_57: P10.7
LED_GREEN_58: P10.11
LED_GREEN_59: P10.15
LED_GREEN_60: P13.3
LED_GREEN_61: P13.7
LED_GREEN_62: P13.11
LED_GREEN_63: P13.15
LED_RED_0: P2.2
LED_RED_1: P2.6
LED_RED_2: P2.10
LED_RED_3: P2.14
LED_RED_4: P5.2
LED_RED_5: P5.6
LED_RED_6: P5.10
LED_RED_7: P5.14
LED_RED_8: P8.2
LED_RED_9: P8.6
LED_RED_10: P8.10
LED_RED_11: P8.14
LED_RED_12: P11.2
LED_RED_13: P11.6
LED_RED_14: P11.10
LED_RED_15: P11.14
LED_RED_16: P30.2
LED_RED_17: P30.6
LED_RED_18: P30.10
LED_RED_19: P30.14
LED_RED_20: P32.2
LED_RED_21: P32.6
LED_RED_22: P32.10
LED_RED_23: P32.14
LED_RED_24: P3.2
LED_RED_25: P3.6
LED_RED_26: P3.10
LED_RED_27: P3.14
LED_RED_28: P6.2
LED_RED_29: P6.6
LED_RED_30: P6.10
LED_RED_31: P6.14
LED_RED_32: P9.2
LED_RED_33: P9.6
LED_RED_34: P9.10
LED_RED_35: P9.14
LED_RED_36: P12.2
LED_RED_37: P12.6
LED_RED_38: P12.10
LED_RED_39: P12.14
LED_RED_40: P31.2
LED_RED_41: P31.6
LED_RED_42: P31.10
LED_RED_43: P31.14
LED_RED_44: P33.2
LED_RED_45: P33.6
LED_RED_46: P33.10
LED_RED_47: P33.14
LED_RED_48: P4.2
LED_RED_49: P4.6
LED_RED_50: P4.10
LED_RED_51: P4.14
LED_RED_52: P7.2
LED_RED_53: P7.6
LED_RED_54: P7.10
LED_RED_55: P7.14
LED_RED_56: P10.2
LED_RED_57: P10.6
LED_RED_58: P10.10
LED_RED_59: P10.14
LED_RED_60: P13.2
LED_RED_61: P13.6
LED_RED_62: P13.10
LED_RED_63: P13.14

### Library data of the parts
P2-P13 P30-P33 = Header 8X2: Header, 8-Pin, Dual row; LatestRevisionDate: 17-Jul-2002; LatestRevisionNote: Re-released for DXP Platform.; Publisher: Altium Limited

## Nets that join several sheets
GND: USB (13 pins), BLUELED (48 pins), REDLED (48 pins), TILE_DEMUX (81 pins), NEWLED (48 pins)
VCC: BLUELED (16 pins), REDLED (16 pins), TILE_DEMUX (17 pins), NEWLED (16 pins), LED_HEADERS (64 pins)
LED_BLUE_0: REDLED (U17.7), LED_HEADERS (P2.4)
LED_BLUE_1: REDLED (U17.9), LED_HEADERS (P2.8)
LED_BLUE_2: REDLED (U17.12), LED_HEADERS (P2.12)
LED_BLUE_3: REDLED (U17.14), LED_HEADERS (P2.16)
LED_BLUE_4: REDLED (U19.7), LED_HEADERS (P5.4)
LED_BLUE_5: REDLED (U19.9), LED_HEADERS (P5.8)
LED_BLUE_6: REDLED (U19.12), LED_HEADERS (P5.12)
LED_BLUE_7: REDLED (U19.14), LED_HEADERS (P5.16)
LED_BLUE_8: REDLED (U20.7), LED_HEADERS (P8.4)
LED_BLUE_9: REDLED (U20.9), LED_HEADERS (P8.8)
LED_BLUE_10: REDLED (U20.12), LED_HEADERS (P8.12)
LED_BLUE_11: REDLED (U20.14), LED_HEADERS (P8.16)
LED_BLUE_12: REDLED (U18.7), LED_HEADERS (P11.4)
LED_BLUE_13: REDLED (U18.9), LED_HEADERS (P11.8)
LED_BLUE_14: REDLED (U18.12), LED_HEADERS (P11.12)
LED_BLUE_15: REDLED (U18.14), LED_HEADERS (P11.16)
LED_BLUE_32: BLUELED (U1.7), LED_HEADERS (P9.4)
LED_BLUE_33: BLUELED (U1.9), LED_HEADERS (P9.8)
LED_BLUE_34: BLUELED (U1.12), LED_HEADERS (P9.12)
LED_BLUE_35: BLUELED (U1.14), LED_HEADERS (P9.16)
LED_BLUE_36: BLUELED (U3.7), LED_HEADERS (P12.4)
LED_BLUE_37: BLUELED (U3.9), LED_HEADERS (P12.8)
LED_BLUE_38: BLUELED (U3.12), LED_HEADERS (P12.12)
LED_BLUE_39: BLUELED (U3.14), LED_HEADERS (P12.16)
LED_BLUE_40: BLUELED (U4.7), LED_HEADERS (P31.4)
LED_BLUE_41: BLUELED (U4.9), LED_HEADERS (P31.8)
LED_BLUE_42: BLUELED (U4.12), LED_HEADERS (P31.12)
LED_BLUE_43: BLUELED (U4.14), LED_HEADERS (P31.16)
LED_BLUE_44: BLUELED (U2.7), LED_HEADERS (P33.4)
LED_BLUE_45: BLUELED (U2.9), LED_HEADERS (P33.8)
LED_BLUE_46: BLUELED (U2.12), LED_HEADERS (P33.12)
LED_BLUE_47: BLUELED (U2.14), LED_HEADERS (P33.16)
LED_BLUE_48: NEWLED (U10.7), LED_HEADERS (P4.4)
LED_BLUE_49: NEWLED (U10.9), LED_HEADERS (P4.8)
LED_BLUE_50: NEWLED (U10.12), LED_HEADERS (P4.12)
LED_BLUE_51: NEWLED (U10.14), LED_HEADERS (P4.16)
LED_BLUE_52: NEWLED (U12.7), LED_HEADERS (P7.4)
LED_BLUE_53: NEWLED (U12.9), LED_HEADERS (P7.8)
LED_BLUE_54: NEWLED (U12.12), LED_HEADERS (P7.12)
LED_BLUE_55: NEWLED (U12.14), LED_HEADERS (P7.16)
LED_BLUE_56: NEWLED (U13.7), LED_HEADERS (P10.4)
LED_BLUE_57: NEWLED (U13.9), LED_HEADERS (P10.8)
LED_BLUE_58: NEWLED (U13.12), LED_HEADERS (P10.12)
LED_BLUE_59: NEWLED (U13.14), LED_HEADERS (P10.16)
LED_BLUE_60: NEWLED (U11.7), LED_HEADERS (P13.4)
LED_GREEN_0: REDLED (U17.19), LED_HEADERS (P2.3)
LED_GREEN_1: REDLED (U17.18), LED_HEADERS (P2.7)
LED_GREEN_2: REDLED (U17.17), LED_HEADERS (P2.11)
LED_GREEN_3: REDLED (U17.16), LED_HEADERS (P2.15)
LED_GREEN_4: REDLED (U19.19), LED_HEADERS (P5.3)
LED_GREEN_5: REDLED (U19.18), LED_HEADERS (P5.7)
LED_GREEN_6: REDLED (U19.17), LED_HEADERS (P5.11)
LED_GREEN_7: REDLED (U19.16), LED_HEADERS (P5.15)
LED_GREEN_8: REDLED (U20.19), LED_HEADERS (P8.3)
LED_GREEN_9: REDLED (U20.18), LED_HEADERS (P8.7)
LED_GREEN_10: REDLED (U20.17), LED_HEADERS (P8.11)
LED_GREEN_11: REDLED (U20.16), LED_HEADERS (P8.15)
LED_GREEN_12: REDLED (U18.19), LED_HEADERS (P11.3)
LED_GREEN_13: REDLED (U18.18), LED_HEADERS (P11.7)
LED_GREEN_14: REDLED (U18.17), LED_HEADERS (P11.11)
LED_GREEN_15: REDLED (U18.16), LED_HEADERS (P11.15)
LED_GREEN_32: BLUELED (U1.19), LED_HEADERS (P9.3)
LED_GREEN_33: BLUELED (U1.18), LED_HEADERS (P9.7)
LED_GREEN_34: BLUELED (U1.17), LED_HEADERS (P9.11)
LED_GREEN_35: BLUELED (U1.16), LED_HEADERS (P9.15)
LED_GREEN_36: BLUELED (U3.19), LED_HEADERS (P12.3)
LED_GREEN_37: BLUELED (U3.18), LED_HEADERS (P12.7)
LED_GREEN_38: BLUELED (U3.17), LED_HEADERS (P12.11)
LED_GREEN_39: BLUELED (U3.16), LED_HEADERS (P12.15)
LED_GREEN_40: BLUELED (U4.19), LED_HEADERS (P31.3)
LED_GREEN_41: BLUELED (U4.18), LED_HEADERS (P31.7)
LED_GREEN_42: BLUELED (U4.17), LED_HEADERS (P31.11)
LED_GREEN_43: BLUELED (U4.16), LED_HEADERS (P31.15)
LED_GREEN_44: BLUELED (U2.19), LED_HEADERS (P33.3)
LED_GREEN_45: BLUELED (U2.18), LED_HEADERS (P33.7)
LED_GREEN_46: BLUELED (U2.17), LED_HEADERS (P33.11)
LED_GREEN_47: BLUELED (U2.16), LED_HEADERS (P33.15)
LED_GREEN_48: NEWLED (U10.19), LED_HEADERS (P4.3)
LED_GREEN_49: NEWLED (U10.18), LED_HEADERS (P4.7)
LED_GREEN_50: NEWLED (U10.17), LED_HEADERS (P4.11)
LED_GREEN_51: NEWLED (U10.16), LED_HEADERS (P4.15)
LED_GREEN_52: NEWLED (U12.19), LED_HEADERS (P7.3)
LED_GREEN_53: NEWLED (U12.18), LED_HEADERS (P7.7)
LED_GREEN_54: NEWLED (U12.17), LED_HEADERS (P7.11)
LED_GREEN_55: NEWLED (U12.16), LED_HEADERS (P7.15)
LED_GREEN_56: NEWLED (U13.19), LED_HEADERS (P10.3)
LED_GREEN_57: NEWLED (U13.18), LED_HEADERS (P10.7)
LED_GREEN_58: NEWLED (U13.17), LED_HEADERS (P10.11)
LED_GREEN_59: NEWLED (U13.16), LED_HEADERS (P10.15)
LED_GREEN_60: NEWLED (U11.19), LED_HEADERS (P13.3)
LED_GREEN_61: NEWLED (U11.18), LED_HEADERS (P13.7)
LED_GREEN_62: NEWLED (U11.17), LED_HEADERS (P13.11)
LED_GREEN_63: NEWLED (U11.16), LED_HEADERS (P13.15)
LED_MODE: BLUELED (U1.26 U2.26 U3.26 U4.26), REDLED (U17.26 U18.26 U19.26 U20.26), NEWLED (U10.26 U11.26 U12.26 U13.26)
LED_RED_0: REDLED (U17.6), LED_HEADERS (P2.2)
LED_RED_1: REDLED (U17.8), LED_HEADERS (P2.6)
LED_RED_2: REDLED (U17.11), LED_HEADERS (P2.10)
LED_RED_3: REDLED (U17.13), LED_HEADERS (P2.14)
LED_RED_4: REDLED (U19.6), LED_HEADERS (P5.2)
LED_RED_5: REDLED (U19.8), LED_HEADERS (P5.6)
LED_RED_6: REDLED (U19.11), LED_HEADERS (P5.10)
LED_RED_7: REDLED (U19.13), LED_HEADERS (P5.14)
LED_RED_8: REDLED (U20.6), LED_HEADERS (P8.2)
LED_RED_9: REDLED (U20.8), LED_HEADERS (P8.6)
LED_RED_10: REDLED (U20.11), LED_HEADERS (P8.10)
LED_RED_11: REDLED (U20.13), LED_HEADERS (P8.14)
LED_RED_12: REDLED (U18.6), LED_HEADERS (P11.2)
LED_RED_13: REDLED (U18.8), LED_HEADERS (P11.6)
LED_RED_14: REDLED (U18.11), LED_HEADERS (P11.10)
LED_RED_15: REDLED (U18.13), LED_HEADERS (P11.14)
LED_RED_32: BLUELED (U1.6), LED_HEADERS (P9.2)
LED_RED_33: BLUELED (U1.8), LED_HEADERS (P9.6)
LED_RED_34: BLUELED (U1.11), LED_HEADERS (P9.10)
LED_RED_35: BLUELED (U1.13), LED_HEADERS (P9.14)
LED_RED_36: BLUELED (U3.6), LED_HEADERS (P12.2)
LED_RED_37: BLUELED (U3.8), LED_HEADERS (P12.6)
LED_RED_38: BLUELED (U3.11), LED_HEADERS (P12.10)
LED_RED_39: BLUELED (U3.13), LED_HEADERS (P12.14)
LED_RED_40: BLUELED (U4.6), LED_HEADERS (P31.2)
LED_RED_41: BLUELED (U4.8), LED_HEADERS (P31.6)
LED_RED_42: BLUELED (U4.11), LED_HEADERS (P31.10)
LED_RED_43: BLUELED (U4.13), LED_HEADERS (P31.14)
LED_RED_44: BLUELED (U2.6), LED_HEADERS (P33.2)
LED_RED_45: BLUELED (U2.8), LED_HEADERS (P33.6)
LED_RED_46: BLUELED (U2.11), LED_HEADERS (P33.10)
LED_RED_47: BLUELED (U2.13), LED_HEADERS (P33.14)
LED_RED_48: NEWLED (U10.6), LED_HEADERS (P4.2)
LED_RED_49: NEWLED (U10.8), LED_HEADERS (P4.6)
LED_RED_50: NEWLED (U10.11), LED_HEADERS (P4.10)
LED_RED_51: NEWLED (U10.13), LED_HEADERS (P4.14)
LED_RED_52: NEWLED (U12.6), LED_HEADERS (P7.2)
LED_RED_53: NEWLED (U12.8), LED_HEADERS (P7.6)
LED_RED_54: NEWLED (U12.11), LED_HEADERS (P7.10)
LED_RED_55: NEWLED (U12.13), LED_HEADERS (P7.14)
LED_RED_56: NEWLED (U13.6), LED_HEADERS (P10.2)
LED_RED_57: NEWLED (U13.8), LED_HEADERS (P10.6)
LED_RED_58: NEWLED (U13.11), LED_HEADERS (P10.10)
LED_RED_59: NEWLED (U13.13), LED_HEADERS (P10.14)
LED_RED_60: NEWLED (U11.6), LED_HEADERS (P13.2)
LED_RED_61: NEWLED (U11.8), LED_HEADERS (P13.6)
SPI_CLK: BLUELED (U1.32 U2.32 U3.32 U4.32), REDLED (U17.32 U18.32 U19.32 U20.32), NEWLED (U10.32 U11.32 U12.32 U13.32)
SPI_MOSI: BLUELED (U1.1 U2.1 U3.1 U4.1), REDLED (U17.1 U18.1 U19.1 U20.1), NEWLED (U10.1 U11.1 U12.1 U13.1)